# EAGLE design NSE2022_IMGPS_ver0 (EAGLE 9.6.0)
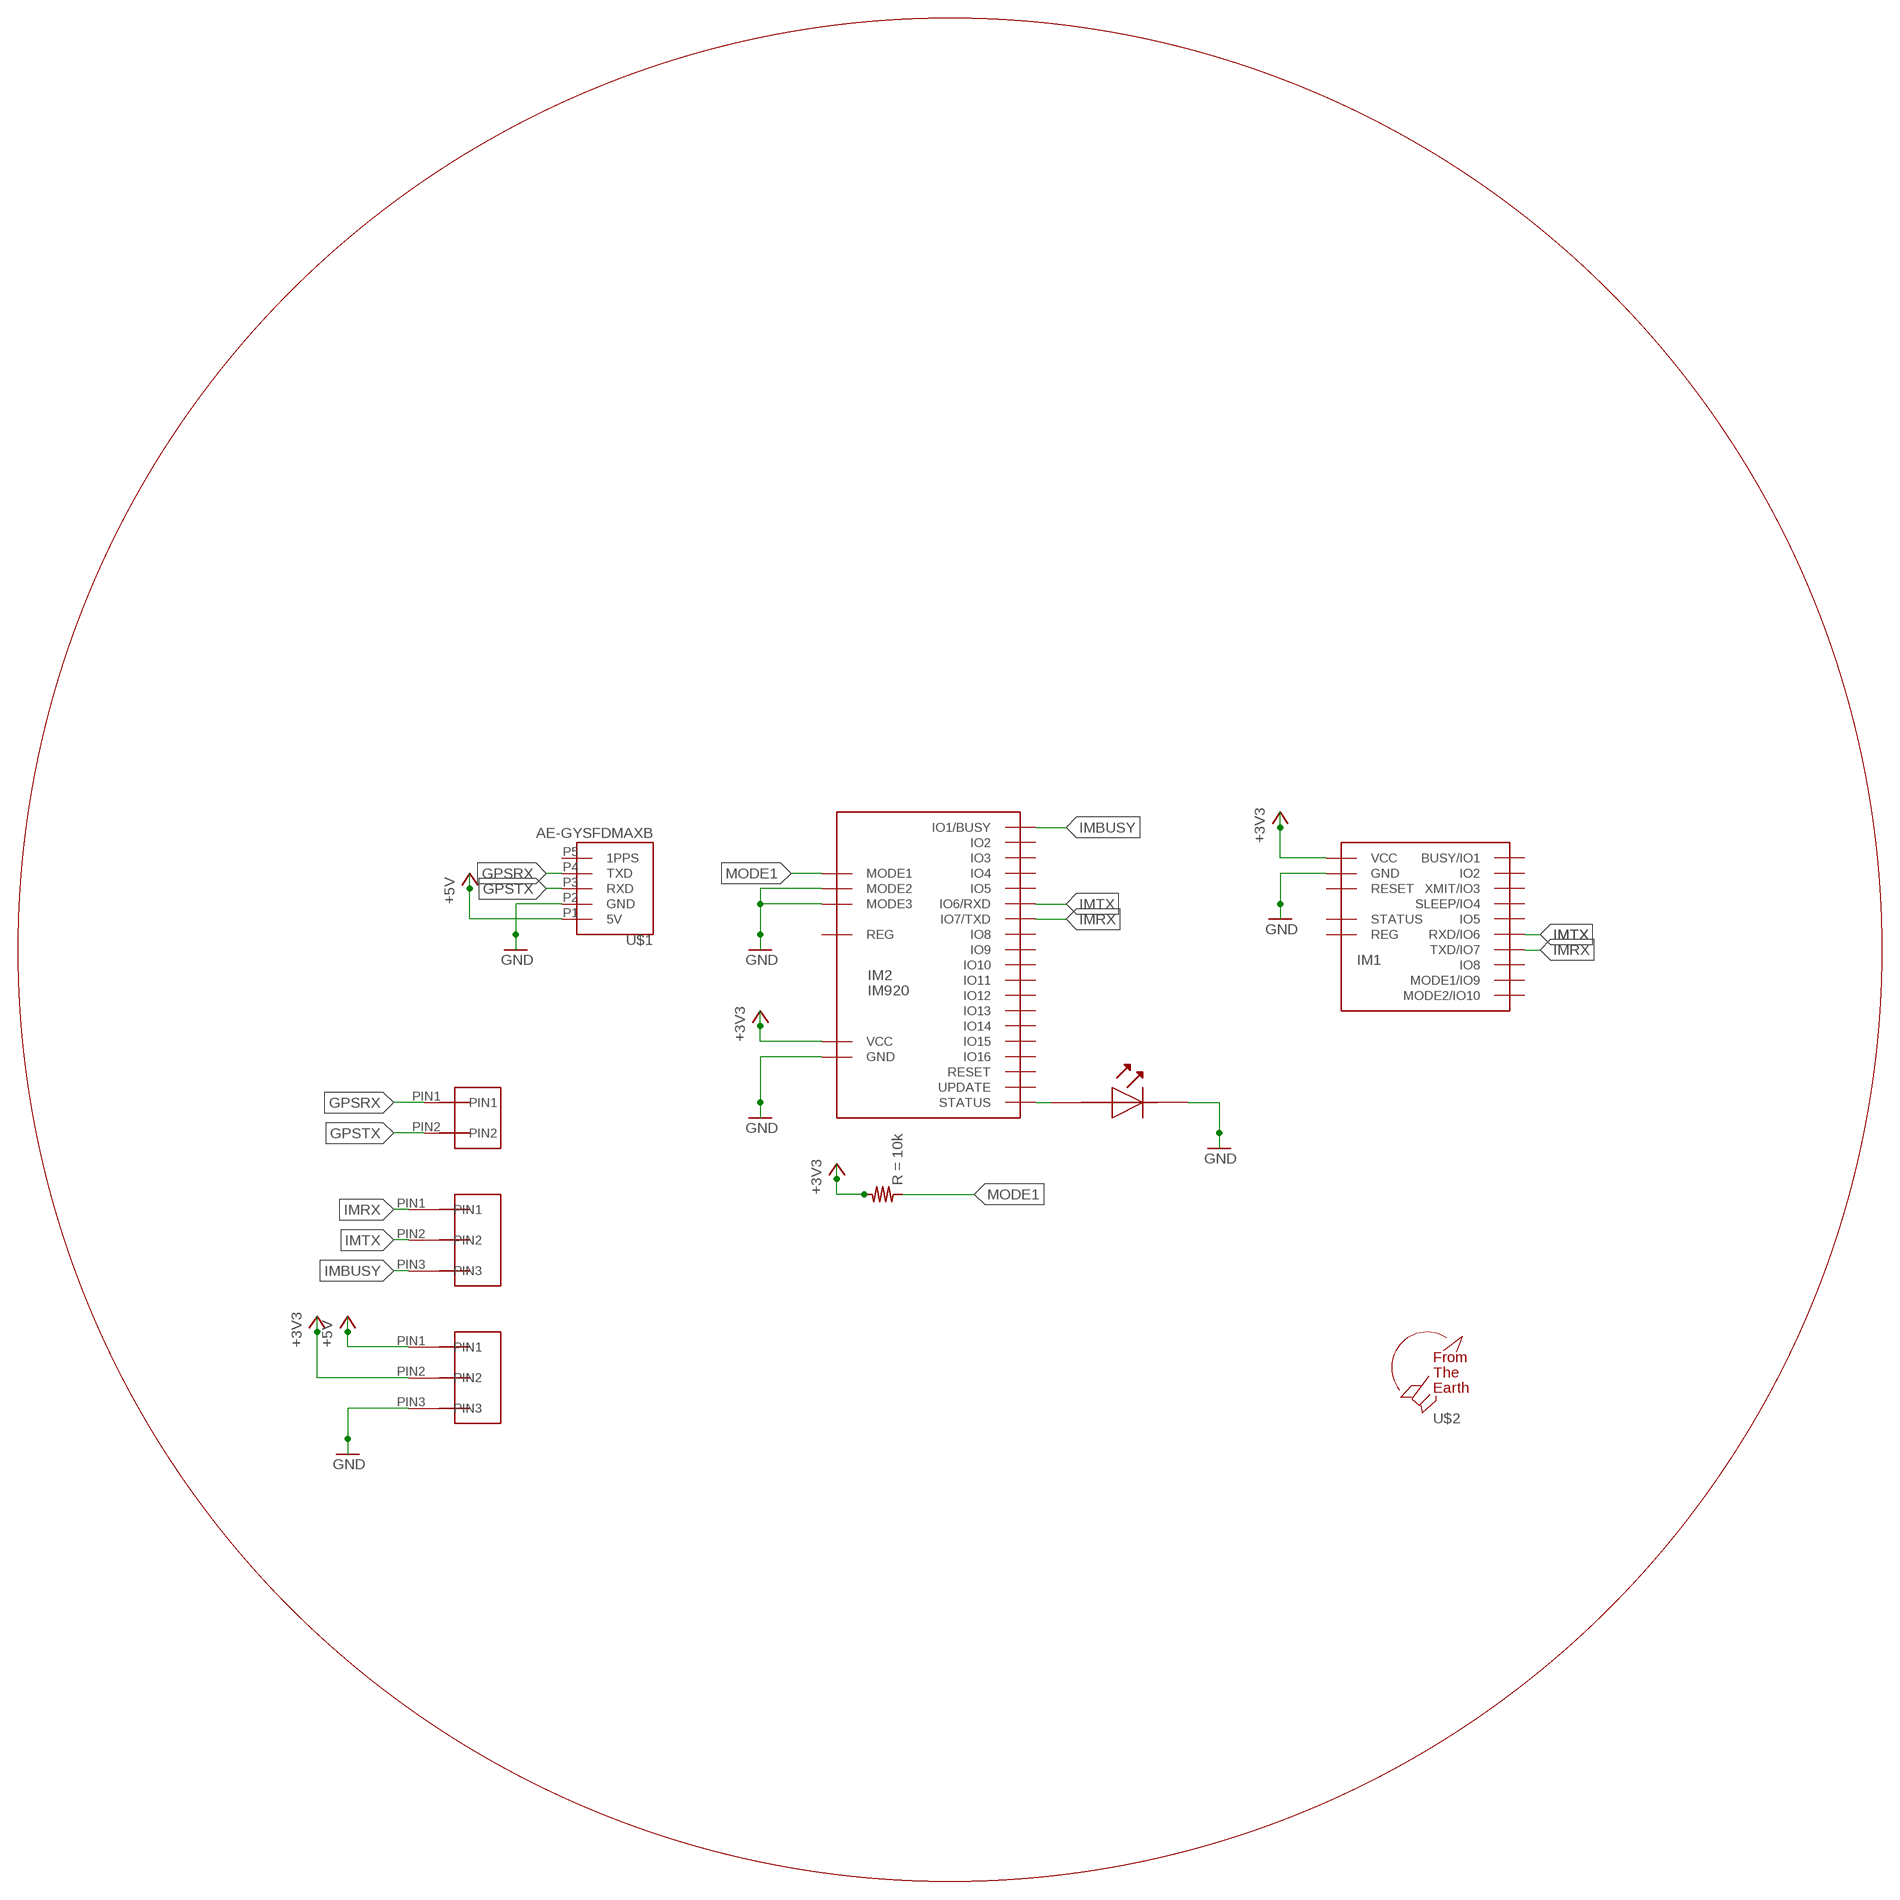
[diagram p0: schematic, sheet 1]

## Parts
IM1  IM920C  [IM920C]
IM2  IM920  [IM920]
R4  RESISTER  [REGISTER]
U$1  AE-GYSFDMAXB  [AE-GYSFDMAXB]
U$2  F.T.E.LOGO  [LOGO]
U$33  2PIN  [2PIN]
U$47  3PIN  [3PIN]
U$48  3PIN  [3PIN]
U$54  LED  [LED]

## Nets
+3V3: IM1.$P17(VCC) IM2.IO23(VCC) R4.B U$48.PIN2
+5V: U$1.P1(5V) U$48.PIN1
GND: IM1.$P18(GND) IM2.IO18(MODE2) IM2.IO19(MODE3) IM2.IO24(GND) U$1.P2(GND) U$48.PIN3 U$54.PLUS(OUT)
GPSRX: U$1.P4(TXD) U$33.PIN1
GPSTX: U$1.P3(RXD) U$33.PIN2
IMBUSY: IM2.IO1(IO1/BUSY) U$47.PIN3
IMRX: IM1.$P7(TXD/IO7) IM2.IO7(IO7/TXD) U$47.PIN1
IMTX: IM1.$P6(RXD/IO6) IM2.IO6(IO6/RXD) U$47.PIN2
MODE1: IM2.IO17(MODE1) R4.A
N$7: IM2.IO21(STATUS) U$54.MINUS(IN)
Unconnected: IM1.$P1(BUSY/IO1) IM1.$P2(IO2) IM1.$P3(XMIT/IO3) IM1.$P4(SLEEP/IO4) IM1.$P5(IO5) IM1.$P8(IO8) IM1.$P9(MODE1/IO9) IM1.$P10(MODE2/IO10) IM1.$P15(STATUS) IM1.$P16(REG) IM1.$P19(RESET) IM2.IO2 IM2.IO3 IM2.IO4 IM2.IO5 IM2.IO8 IM2.IO9 IM2.IO10 IM2.IO11 IM2.IO12 IM2.IO13 IM2.IO14 IM2.IO15 IM2.IO16 IM2.IO20(UPDATE) IM2.IO22(REG) IM2.IO25(RESET) U$1.P5(1PPS)

## Library data of the parts
IM1 = IM920_SET:IM920C
IM2 = IM920:IM920
R4 = normal register:RESISTER; R: 10k
U$1 = AE-GYSFDMAXB:AE-GYSFDMAXB
U$2 = logo:F.T.E.LOGO
U$33 = 2PIN:2PIN
U$47 U$48 = 3PIN:3PIN
U$54 = LEDkato:LED

## Board
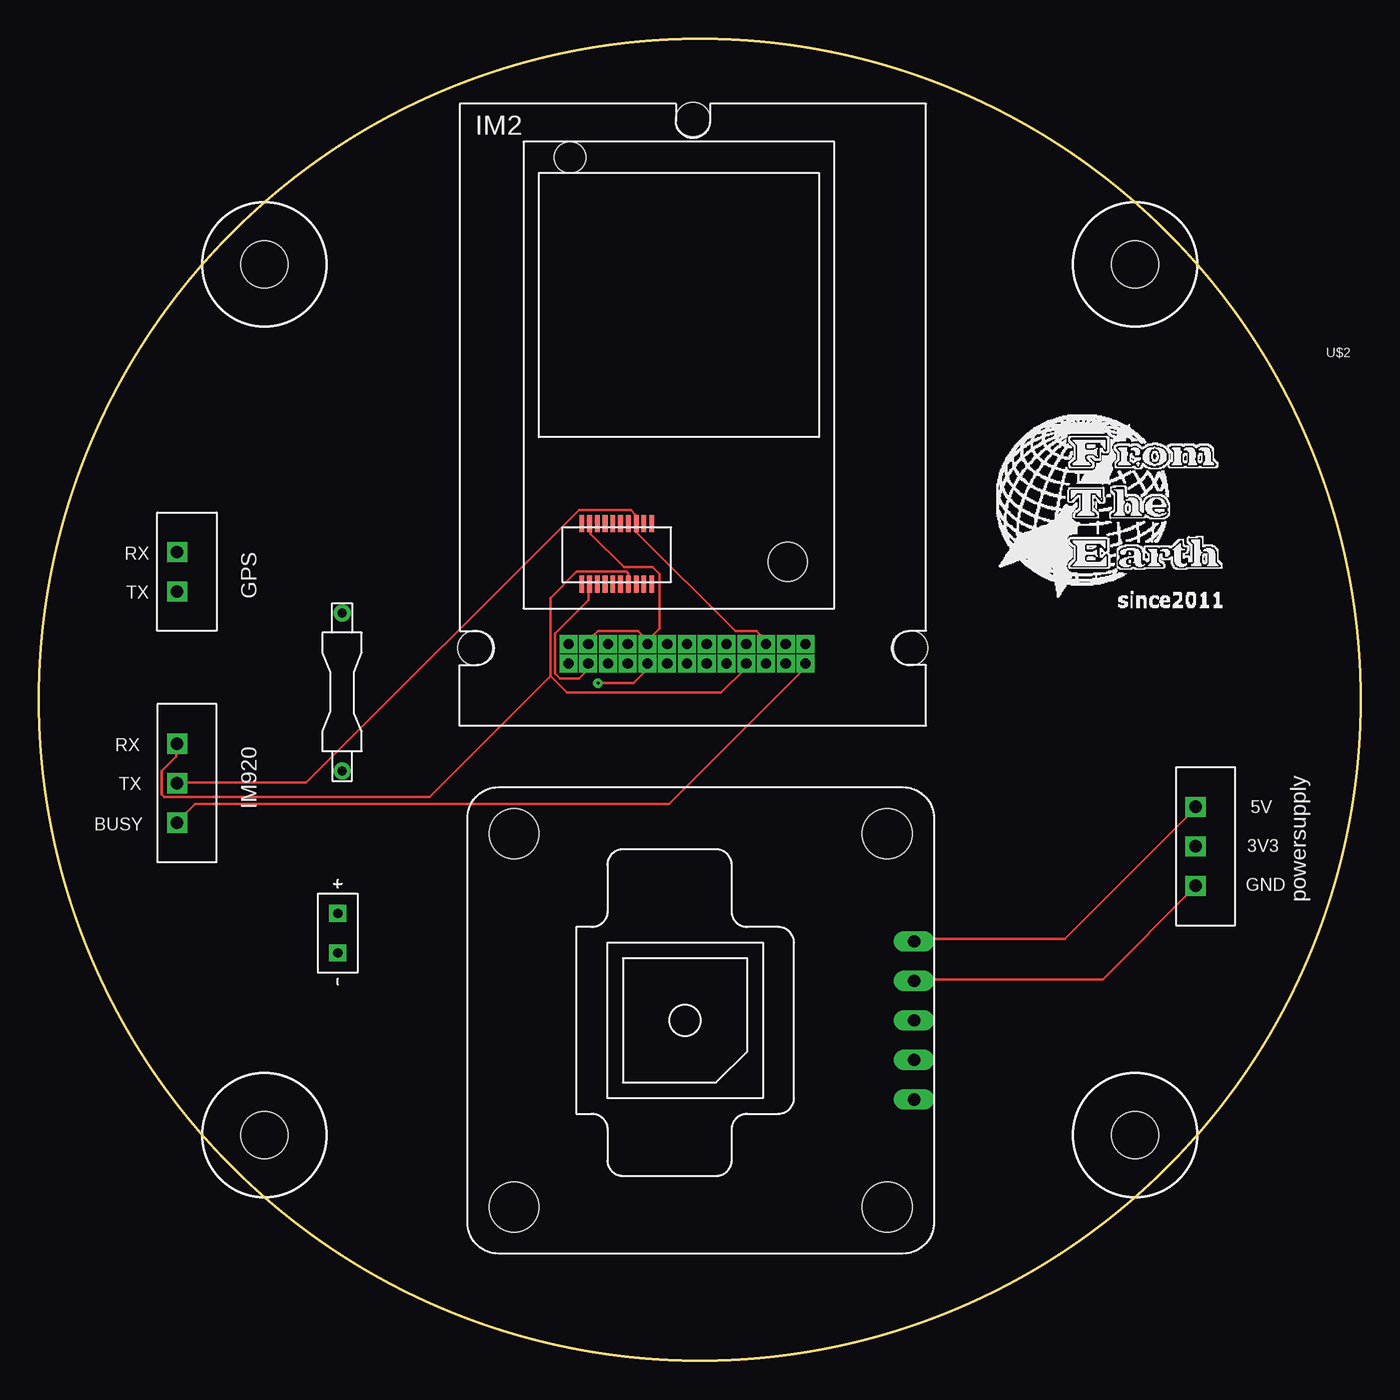
[diagram p1: board, top side]
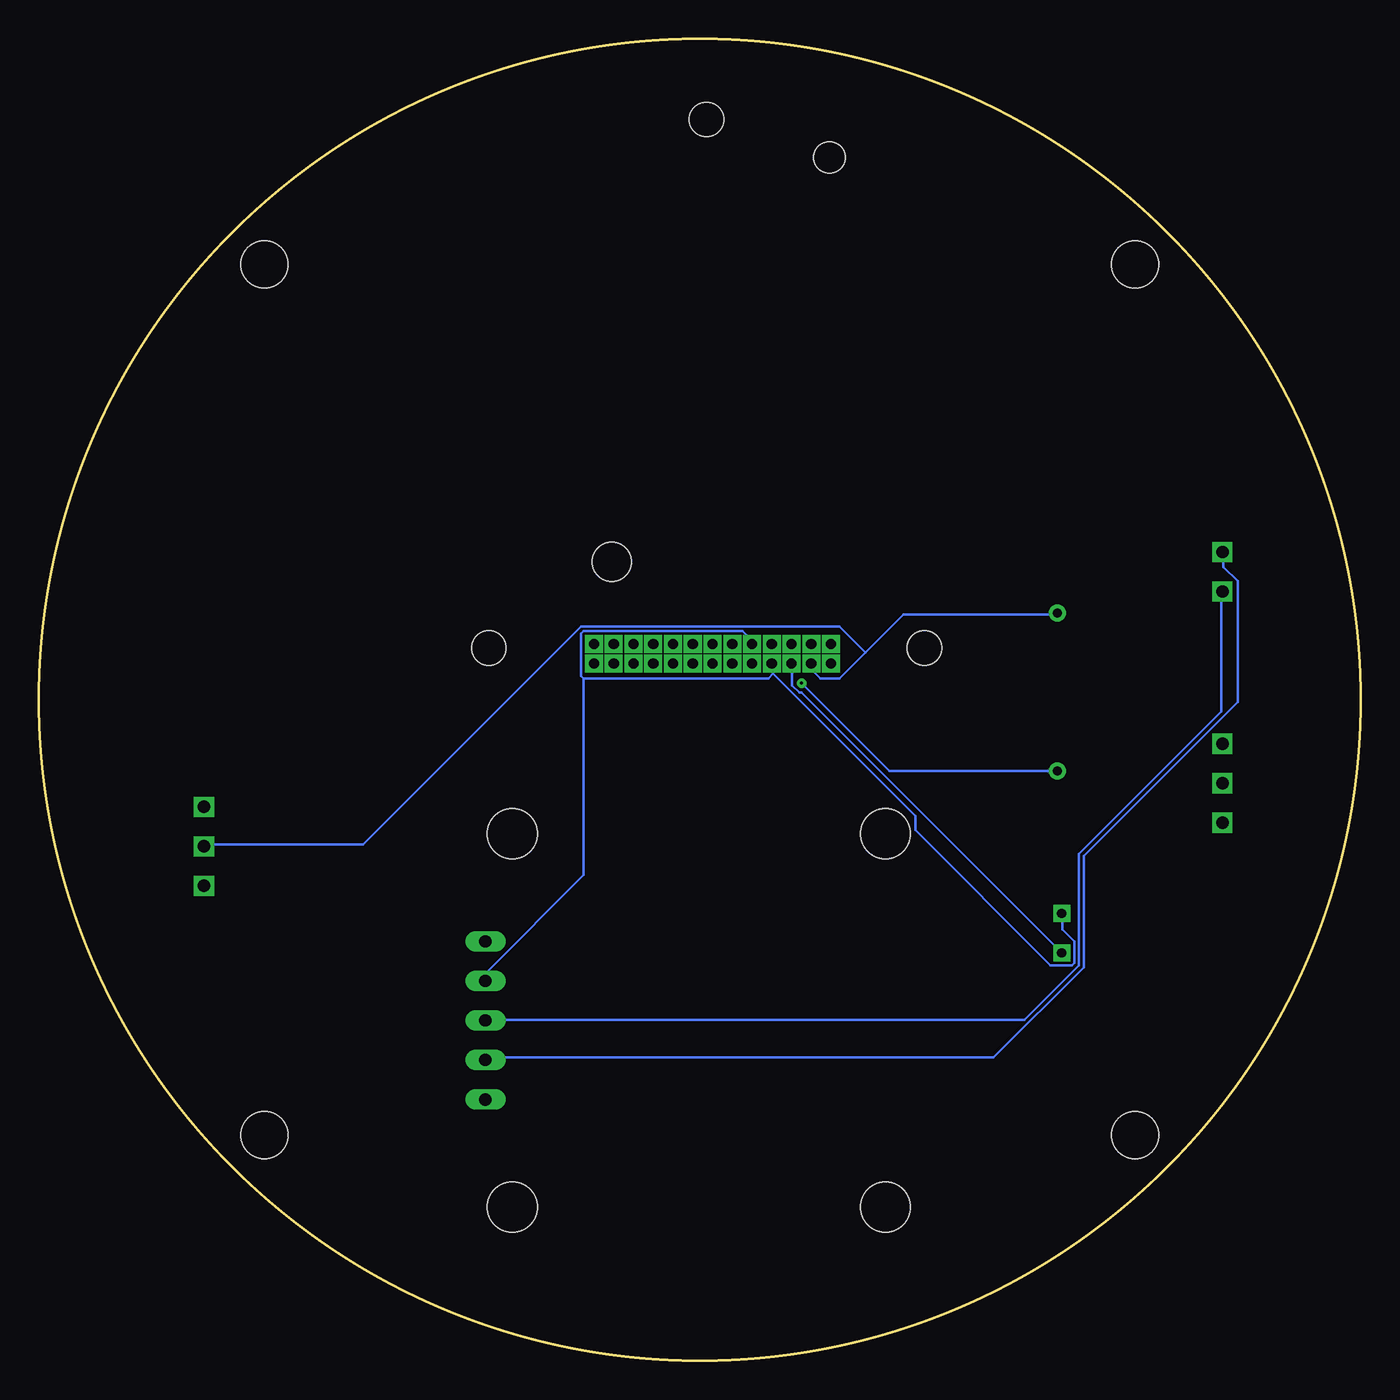
[diagram p2: board, bottom side, seen from below]

Size 85 x 85 mm. Coordinates in mm from the lower left corner, seen from the top.
Outline: circle at 42.5,42.5 radius 42.5
Copper layers (1*16): Top 0.035mm / dielectric 1.5mm / Bottom 0.035mm
Design rules "PCBGoGo": minimum track width 6mil, minimum drill 0.2mm, track to track 6mil, track to pad 6mil, pad to pad 6mil, via to via 6mil, smd to smd 6mil, copper to edge 0.2mm, drill to drill 6mil, minimum pad ring 10mil, minimum via ring 8mil, stop-mask expansion 4mil, vias tented up to drill 0mil, thermal gap 10mil
Holes 3 mm at 70.5,70.5 14.5,70.5 70.5,14.5 14.5,14.5

### Footprints (pad centres in the part's own frame; a part is rotated, then mirrored left to right if it is on the bottom)
IM920C = smd 0.3 x 1.1: $P1 -1.75,-13.45; $P2 -1.75,-9.55; $P3 -2.25,-13.45; $P4 -2.25,-9.55; $P5 -2.75,-13.45; $P6 -2.75,-9.55; $P7 -3.25,-13.45; $P8 -3.25,-9.55; $P9 -3.75,-13.45; $P10 -3.75,-9.55; $P11 -4.25,-13.45; $P12 -4.25,-9.55; $P13 -4.75,-13.45; $P14 -4.75,-9.55; $P15 -5.25,-13.45; $P16 -5.25,-9.55; $P17 -5.75,-13.45; $P18 -5.75,-9.55; $P19 -6.25,-13.45; $P20 -6.25,-9.55 | hole 2.5: 7,-12 | hole 2: -7,14
IM920 = drill 0.65 square: IO1 7.24,-16; IO2 7.24,-14.73; IO3 5.97,-16; IO4 5.97,-14.73; IO5 4.7,-16; IO6 4.7,-14.73; IO7 3.43,-16; IO8 3.43,-14.73; IO9 2.16,-16; IO10 2.16,-14.73; IO11 0.89,-16; IO12 0.89,-14.73; IO13 -0.38,-16; IO14 -0.38,-14.73; IO15 -1.65,-16; IO16 -1.65,-14.73; IO17 -2.92,-16; IO18 -2.92,-14.73; IO19 -4.19,-16; IO20 -4.19,-14.73; IO21 -5.46,-16; IO22 -5.46,-14.73; IO23 -6.73,-16; IO24 -6.73,-14.73; IO25 -8,-16; IO26 -8,-14.73 | hole 2.2: -14,-15; 14,-15; 0,19
REGISTER = drill 0.6: A -5.08,0; B 5.08,0
AE-GYSFDMAXB = drill 0.8 long: P1 13.716,5.08; P2 13.716,2.54; P3 13.716,0; P4 13.716,-2.54; P5 13.716,-5.08 | hole 3.2: -12,12; 12,12; 12,-12; -12,-12
2PIN = drill 0.8 square: PIN1 1.27,0; PIN2 3.81,0
3PIN = drill 0.8 square: PIN1 1.27,0; PIN2 3.81,0; PIN3 6.35,0
LED = drill 0.6 square: MINUS 1.27,0; PLUS 3.81,0

### Placement (x,y rotation side)
IM1  41.16,63.38 0 top
IM2  42.06,60.82 0 top
R4  19.5,43 90 top
U$1  42.56,21.88 0 top
U$2  61,47 0 top
U$33  8.89,53.27 270 top
U$47  8.89,40.95 270 top
U$48  74.39,36.88 270 top
U$54  19.22,24.95 90 top

### Tracks (layer width: path | path; a pad name or v marks a point on that pad's centre or on a via)
+3V3
  Top 0.152: IM1.$P17 35.34,49.81 35.34,48.9 33.2,46.77 33.2,44.18 33.51,43.87 34.73,43.87 35.19,44.33 35.19,44.79 IM2.IO23
  Bottom 0.152: 31.83,45.55 33.51,43.87 34.73,43.87 35.19,44.33 35.19,44.79 IM2.IO23 | 31.83,45.55 29.39,47.99 19.64,47.99 R4.B | 31.83,45.55 33.51,47.22 50.12,47.22 64.14,33.2 74.35,33.2 U$48.PIN2
+5V
  Top 0.152: U$1.P1 56.37,27.11 65.97,27.11 74.35,35.49 U$48.PIN1
GND
  Top 0.152: U$1.P2 56.37,24.52 68.41,24.52 74.35,30.46 U$48.PIN3 | 39.15,46.31 38.99,46.16 IM2.IO18 39.15,46.31 | 39.15,46.31 39.91,47.07 39.91,50.58 39.45,51.03 37.62,51.03 35.49,53.17 35.49,53.78 IM1.$P18 | 39.15,46.31 38.54,46.92 35.95,46.92 35.64,46.62 35.64,46.46 35.34,46.16 IM2.IO24
  Bottom 0.152: 37.78,44.18 28.63,35.03 28.63,34.12 19.95,25.43 18.57,25.43 18.42,25.58 18.42,26.95 19.18,27.72 19.18,28.63 U$54.PLUS | 37.78,44.18 37.78,44.79 IM2.IO19 | 49.97,43.87 50.12,44.02 50.12,46.77 49.97,46.92 39.76,46.92 39.45,46.62 39.45,46.46 39.15,46.16 IM2.IO18 | 49.97,43.87 38.08,43.87 37.78,44.18 | 49.97,43.87 49.97,31.22 56.22,24.97 56.22,24.52 U$1.P2
GPSRX
  Bottom 0.152: U$33.PIN1 8.82,51.95 8.82,51.03 7.91,50.12 7.91,42.35 17.81,32.44 17.81,25.28 23.6,19.49 56.22,19.49 U$1.P4
GPSTX
  Bottom 0.152: U$33.PIN2 8.97,49.36 8.97,41.74 18.12,32.59 18.12,25.43 21.62,21.93 56.22,21.93 U$1.P3
IMBUSY
  Top 0.152: IM2.IO1 49.21,44.79 49.21,44.48 40.52,35.79 10.04,35.79 8.97,34.73 U$47.PIN3
IMRX
  Top 0.152: 32.9,44.02 32.9,49.05 34.58,50.73 37.78,50.73 37.93,50.58 37.93,49.97 IM1.$P7 | 32.9,44.02 33.97,42.96 43.87,42.96 45.4,44.48 45.4,44.79 IM2.IO7 | 32.9,44.02 25.13,36.25 8.06,36.25 7.91,36.4 7.91,37.93 8.82,38.84 8.82,39.6 U$47.PIN1
IMTX
  Top 0.152: IM2.IO6 46.62,46.16 46.62,46.46 46.16,46.92 44.79,46.92 38.38,53.32 38.38,53.78 IM1.$P6 38.38,53.93 38.38,54.39 38.08,54.69 34.73,54.69 17.2,37.17 8.97,37.17 U$47.PIN2
MODE1  (via drill 0.2)
  Top 0.152: v35.95,43.57 38.23,43.57 38.99,44.33 38.99,44.79 IM2.IO17
  Bottom 0.152: v35.95,43.57 30.31,37.93 19.64,37.93 R4.A
N$7
  Bottom 0.152: U$54.MINUS 19.34,26.35 35.95,42.96 36.1,42.96 36.56,43.41 36.56,44.79 IM2.IO21

### Text on the board
tPlace: GPS | RX | TX | RX | IM920 | TX | 5V | BUSY | 3V3 | GND | powersupply